# EAGLE design ver_2 (EAGLE 9.6.2)
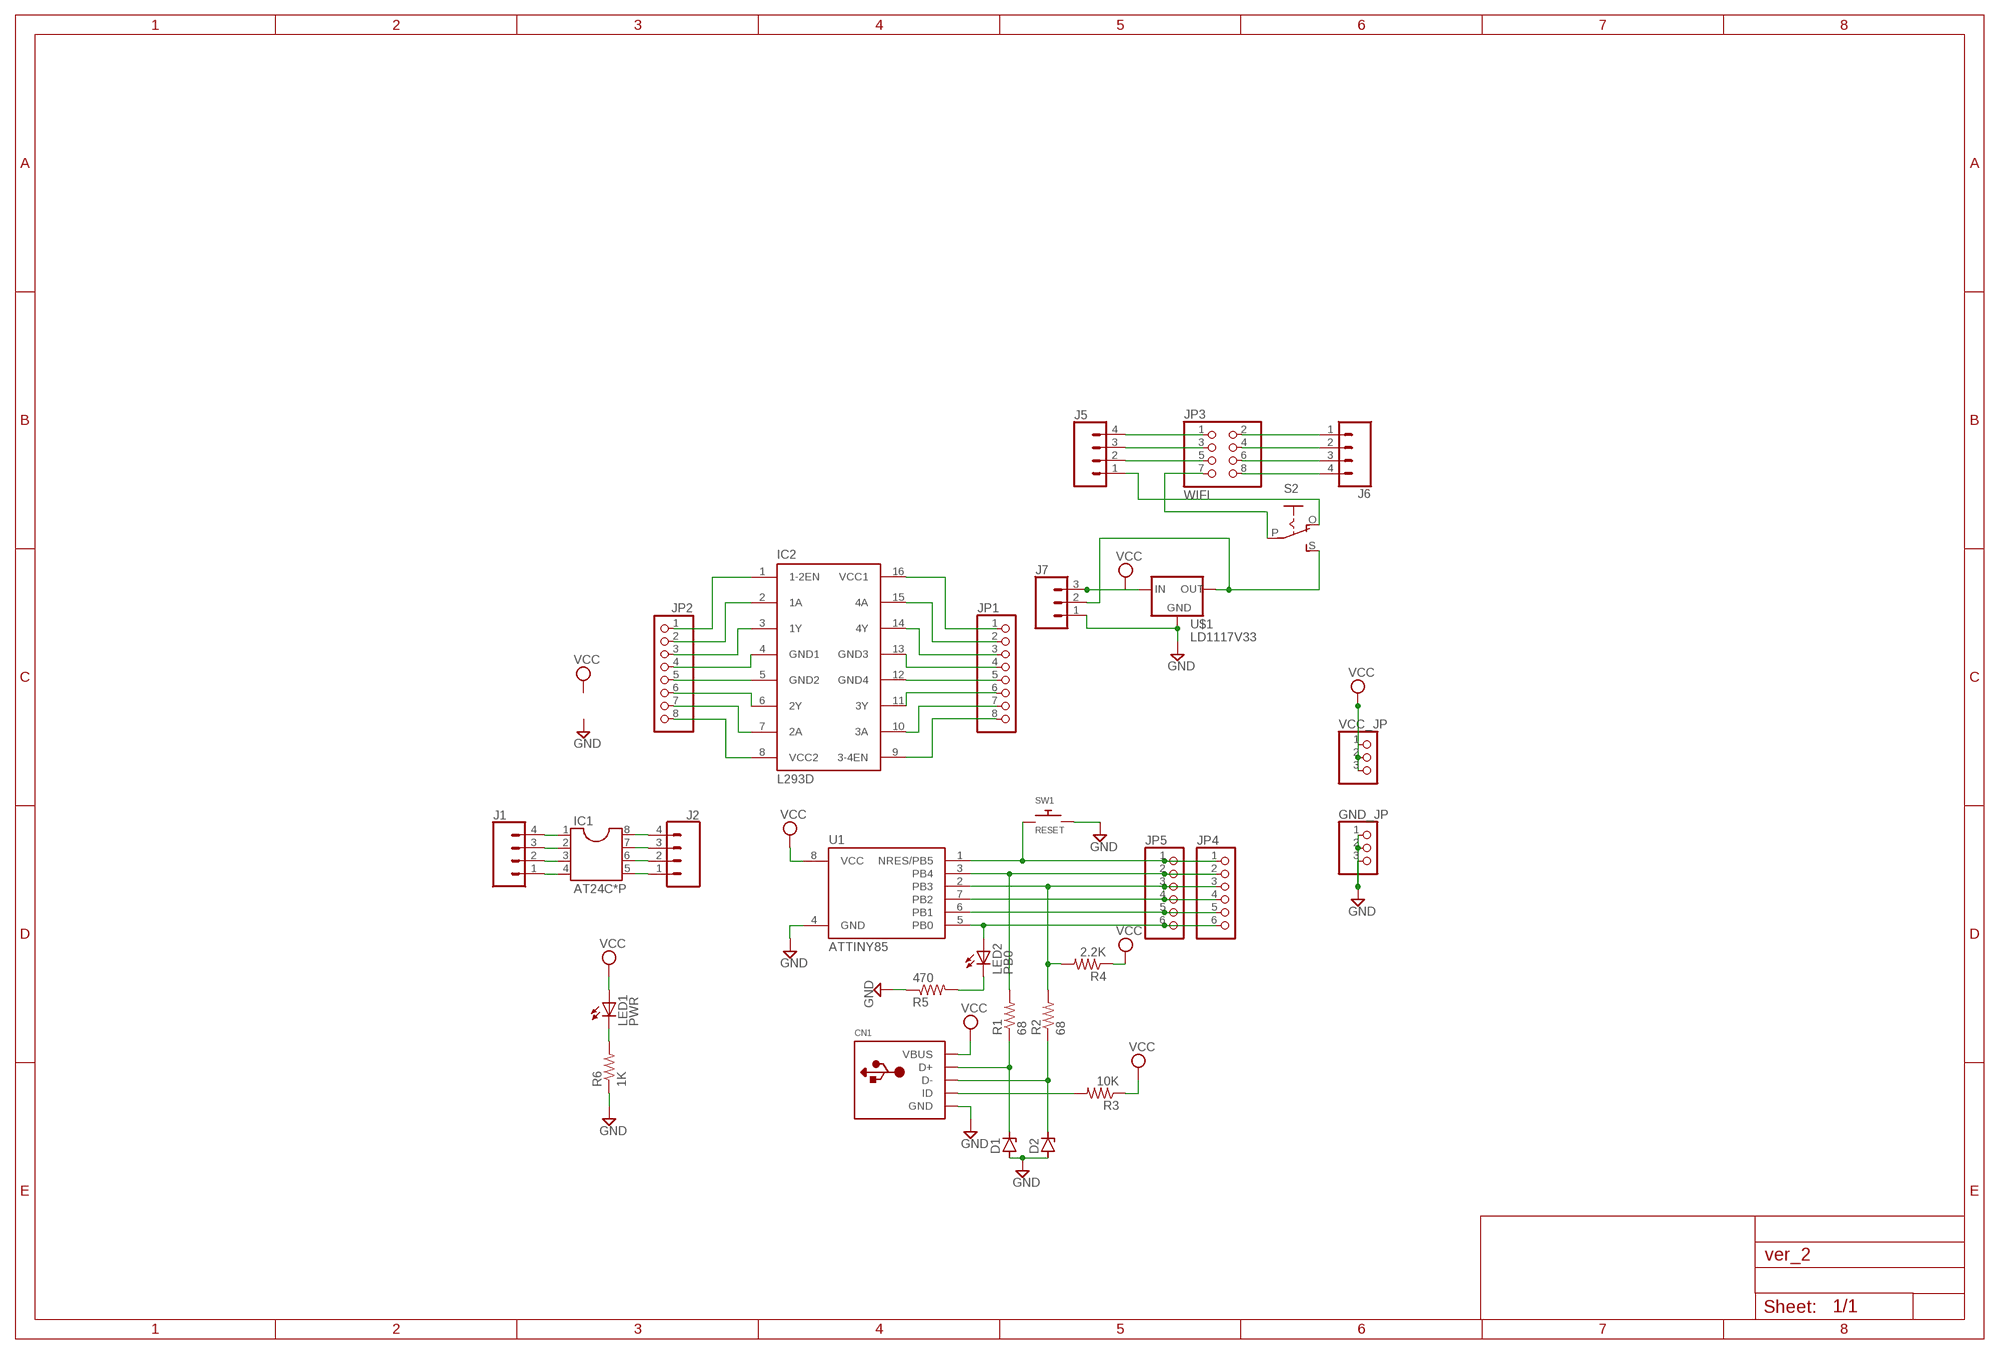
[diagram p0: schematic, sheet 1]

## Parts
CN1  USBTHM  [USB-MINIB-THM]
D1  ZENER-DIODEDO34-7  [DO34Z7]
D2  ZENER-DIODEDO34-7  [DO34Z7]
GND_JP  PINHD-1X3  [1X03]
IC1  AT24C*P  DIL8S  [SOCKET-08]
IC2  L293D  [DIL16]
J1  CONN_041X04_NO_SILK  [1X04_NO_SILK]
J2  CONN_041X04_NO_SILK  [1X04_NO_SILK]
J5  CONN_04PTH  [1X04]
J6  CONN_04PTH  [1X04]
J7  CONN_03  [1X03]
JP1  PINHD-1X8CLEANBIG  [1X08-CLEANBIG]
JP2  PINHD-1X8CLEANBIG  [1X08-CLEANBIG]
JP3  WIFI  PINHD-2X4  [2X04]
JP4  PINHD-1X6  [1X06]
JP5  PINHD-1X6  [1X06]
LED1  PWR  LED3MM  [LED3MM]
LED2  PB0  LED3MM  [LED3MM]
R1  68  R-US_0204/2V  [0204V]
R2  68  R-US_0204/2V  [0204V]
R3  10K  R-US_0204/2V  [0204V]
R4  2.2K  R-US_0204/2V  [0204V]
R5  470  R-US_0204/2V  [0204V]
R6  1K  R-US_0204/2V  [0204V]
S2  EG1218S  [EG1218]
SW1  RESET  SWITCH_PUSHBUTTONEVQ-PE  [TACT_PANA-EVQ]
U1  ATTINY85  ATTINY85-20P  [PDIP08_300MIL]
U$1  LD1117V33  [LD1117V33]
VCC_JP  PINHD-1X3  [1X03]

## Nets
GND: CN1.GND D1.A D2.A GND_JP.1 GND_JP.2 GND_JP.3 J7.1 R5.1 R6.1 SW1.P$2 U1.4(GND) U$1.GND
N$1: JP4.1 JP5.1 SW1.P$1 U1.1(NRES/PB5)
N$2: JP4.2 JP5.2 R1.2 U1.3(PB4)
N$3: JP4.3 JP5.3 R2.2 R4.2 U1.2(PB3)
N$4: JP4.4 JP5.4 U1.7(PB2)
N$5: JP4.5 JP5.5 U1.6(PB1)
N$6: JP4.6 JP5.6 LED2.A U1.5(PB0)
N$7: IC1.4 J1.1
N$8: IC1.3 J1.2
N$9: IC1.2 J1.3
N$10: IC1.1 J1.4
N$11: IC1.5 J2.1
N$12: IC1.6 J2.2
N$13: IC1.7 J2.3
N$14: IC1.8 J2.4
N$15: CN1.ID R3.2
N$16: IC2.4(GND1) JP2.4
N$17: CN1.D+ D1.C R1.1
N$18: CN1.D- D2.C R2.1
N$19: IC2.5(GND2) JP2.5
N$20: IC2.6(2Y) JP2.6
N$21: IC2.7(2A) JP2.7
N$22: IC2.8(VCC2) JP2.8
N$23: IC2.3(1Y) JP2.3
N$24: IC2.2(1A) JP2.2
N$25: IC2.1(1-2EN) JP2.1
N$26: J6.3 JP3.6
N$27: J6.2 JP3.4
N$28: JP3.7 S2.P
N$29: J5.2 JP3.5
N$30: J5.3 JP3.3
N$31: J5.4 JP3.1
N$33: J6.4 JP3.8
N$34: J7.2 S2.S U$1.OUT
N$35: J6.1 JP3.2
N$36: IC2.12(GND4) JP1.5
N$37: IC2.11(3Y) JP1.6
N$38: IC2.10(3A) JP1.7
N$39: IC2.9(3-4EN) JP1.8
N$40: IC2.13(GND3) JP1.4
N$41: IC2.14(4Y) JP1.3
N$42: IC2.15(4A) JP1.2
N$43: IC2.16(VCC1) JP1.1
N$44: LED2.K(C) R5.2
N$45: LED1.K(C) R6.2
N$46: J5.1 S2.O
VCC: CN1.VBUS J7.3 LED1.A R3.1 R4.1 U1.8(VCC) U$1.IN VCC_JP.1 VCC_JP.2 VCC_JP.3

## Library data of the parts
CN1 = adafruit:USB: USB Connectors USBMINIB - Surface Mount Female Mini-B USB Connector 4UConnector: 06564 By microbuilder.eu Thru-hole RA Female Mini-B USB Connector 4UConnector: 18732 By ladyada.net
D1 D2 = diode:ZENER-DIODE: Z-Diode
GND_JP VCC_JP = adafruit:PINHD-1X3: PIN HEADER
IC1 = ic-package:DIL8: Dual In Line / Socket
IC2 = st-microelectronics:L293D: PUSH-PULL 4 CHANNEL DRIVER; MPN: L293D; OC_FARNELL: 9589619; OC_NEWARK: 56P8249
J1 J2 J5 J6 = SparkFun-Connectors:CONN_04: Multi connection point. Often used as Generic Header-pin footprint for 0.1 inch spaced/style header connections On any of the 0.1 inch spaced packages, you can populate with these: Break Away Headers - Straight <https://www.sparkfun.com/products/116> (PRT-00116) Break Away Male Headers - Right Angle <https://www.sparkfun.com/products/553> (PRT-00553) Female Headers <https://www.sparkfun.com/products/115> (PRT-00115) Break Away Headers - Machine Pin <https://www.sparkfun.com/products/117> (PRT-00117) Break Away Female Headers - Swiss Machine Pin <https://www.sparkfun.com/products/743> (PRT-00743) For SCREWTERMINALS and SPRING TERMINALS visit here: Screw Terimnals on SparkFun.com <https://www.sparkfun.com/search/results?term=Screw+Terminals> (5mm/3.5mm/2.54mm spacing) This device is also useful as a general connection point to wire up your design to another part of your project. Our various solder wires solder well into these plated through hole pads. Hook-Up Wire - Assortment (Stranded, 22 AWG) <https://www.sparkfun.com/products/11375> (PRT-11375) Hook-Up Wire - Assortment (Solid Core, 22 AWG) <https://www.sparkfun.com/products/11367> (PRT-11367) View the entire wire category on our website here <https://www.sparkfun.com/categories/141> Special notes: Molex polarized connector foot print use with SKU : PRT-08231 with associated crimp pins and housings. 1MM SMD Version SKU: PRT-10208; PROD_ID: CONN-09696
J7 = SparkFun-Connectors:CONN_03: Multi connection point. Often used as Generic Header-pin footprint for 0.1 inch spaced/style header connections On any of the 0.1 inch spaced packages, you can populate with these: Break Away Headers - Straight <https://www.sparkfun.com/products/116> (PRT-00116) Break Away Male Headers - Right Angle <https://www.sparkfun.com/products/553> (PRT-00553) Female Headers <https://www.sparkfun.com/products/115> (PRT-00115) Break Away Headers - Machine Pin <https://www.sparkfun.com/products/117> (PRT-00117) Break Away Female Headers - Swiss Machine Pin <https://www.sparkfun.com/products/743> (PRT-00743) Stackable Header - 3 Pin (Female, 0.1") <https://www.sparkfun.com/products/13875> (PRT-13875) For SCREWTERMINALS and SPRING TERMINALS visit here: Screw Terimnals on SparkFun.com <https://www.sparkfun.com/search/results?term=Screw+Terminals> (5mm/3.5mm/2.54mm spacing) This device is also useful as a general connection point to wire up your design to another part of your project. Our various solder wires solder well into these plated through hole pads. Hook-Up Wire - Assortment (Stranded, 22 AWG) <https://www.sparkfun.com/products/11375> (PRT-11375) Hook-Up Wire - Assortment (Solid Core, 22 AWG) <https://www.sparkfun.com/products/11367> (PRT-11367) View the entire wire category on our website here <https://www.sparkfun.com/categories/141> Special notes: Molex polarized connector foot print use with SKU : PRT-08232 with associated crimp pins and housings.; PROD_ID: XXX-00000; VALUE: 455-1750-1-ND
JP1 JP2 = adafruit:PINHD-1X8: PIN HEADER
JP3 = adafruit:PINHD-2X4: PIN HEADER
JP4 JP5 = adafruit:PINHD-1X6: PIN HEADER
LED1 LED2 = adafruit:LED: LED OSRAM: - CHIPLED LG R971, LG N971, LY N971, LG Q971, LY Q971, LO R971, LY R971 LH N974, LH R974 LS Q976, LO Q976, LY Q976 LO Q996 - Hyper CHIPLED LW Q18S LB Q993, LB Q99A, LB R99A - SideLED LS A670, LO A670, LY A670, LG A670, LP A670 LB A673, LV A673, LT A673, LW A673 LH A674 LY A675 LS A676, LA A676, LO A676, LY A676, LW A676 LS A679, LY A679, LG A679 - Hyper Micro SIDELED® LS Y876, LA Y876, LO Y876, LY Y876 LT Y87S - SmartLED LW L88C, LW L88S LB L89C, LB L89S, LG L890 LS L89K, LO L89K, LY L89K LS L896, LA L896, LO L896, LY L896 - TOPLED LS T670, LO T670, LY T670, LG T670, LP T670 LSG T670, LSP T670, LSY T670, LOP T670, LYG T670 LG T671, LOG T671, LSG T671 LB T673, LV T673, LT T673, LW T673 LH T674 LS T676, LA T676, LO T676, LY T676, LB T676, LH T676, LSB T676, LW T676 LB T67C, LV T67C, LT T67C, LS T67K, LO T67K, LY T67K, LW E67C LS E67B, LA E67B, LO E67B, LY E67B, LB E67C, LV E67C, LT E67C LW T67C LS T679, LY T679, LG T679 LS T770, LO T770, LY T770, LG T770, LP T770 LB T773, LV T773, LT T773, LW T773 LH T774 LS E675, LA E675, LY E675, LS T675 LS T776, LA T776, LO T776, LY T776, LB T776 LHGB T686 LT T68C, LB T68C - Hyper Mini TOPLED® LB M676 - Mini TOPLED Santana® LG M470 LS M47K, LO M47K, LY M47K Source: http://www.osram.convergy.de/
R1-R6 = adafruit:R-US_: RESISTOR, American symbol
S2 = adafruit:EG1218: SLIDING SWITCH 0.1" spacing through hole, vertical SPDT slide switch http://www.ladyada.net/library/pcb/eaglelibrary.html
SW1 = adafruit:SWITCH_PUSHBUTTON: Buttons SOFTTOUCHSMD_SJ - Soft touch temporary push button (Super Junk Akihabara) Compatible with SKPMANE010 [Mouser: 688-SKPMAN] C&K_KSS = Digikey: KSS221GLFS
U1 = _hhn_attiny25_45_85:ATTINY85*: ATMEL ATtiny 85 Packages: P = PDIP 08 30mil S = SOIC 08 EIAJ 208mil Technologies Note: for complete ordering code (temp. range, finish, tape&reel etc.) see www.atmel.com • Supply Voltage: V = (1.8…5.5)V | [blank] = (2.7…5.5)V • Speed: 10 = 10 MHz | 20 = 20 MHz Author: Dipl.-Ing. FH Rainer Bayer HHN Hochschule Heilbronn (Heilbronn University), rainer.bayer@hs-heilbronn.de Ingenieurbüro ing-rb, mail@ing-rb.de
U$1 = LD1117V33:LD1117V33

## Board
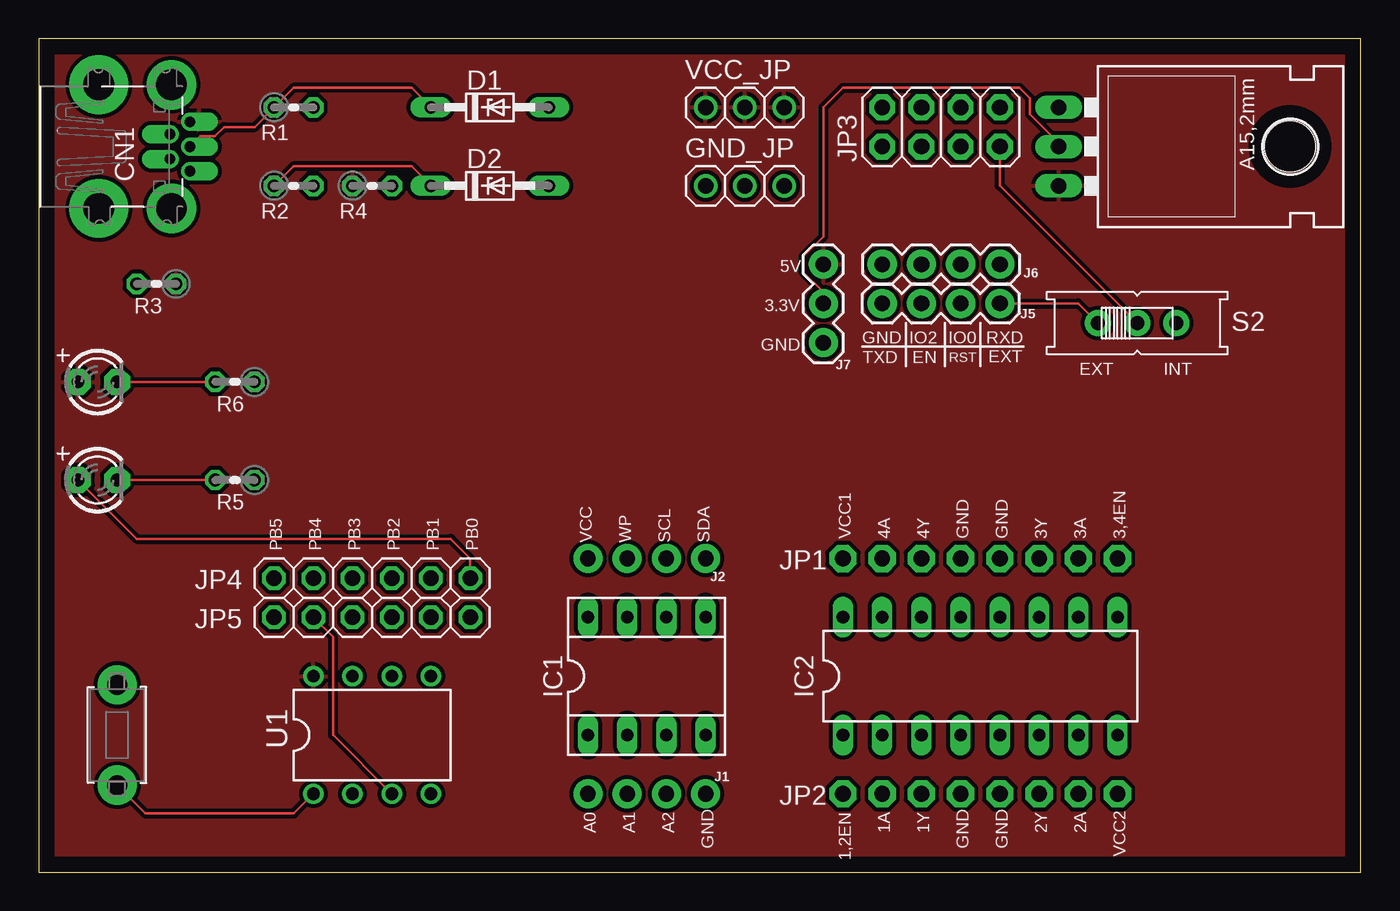
[diagram p1: board, top side]
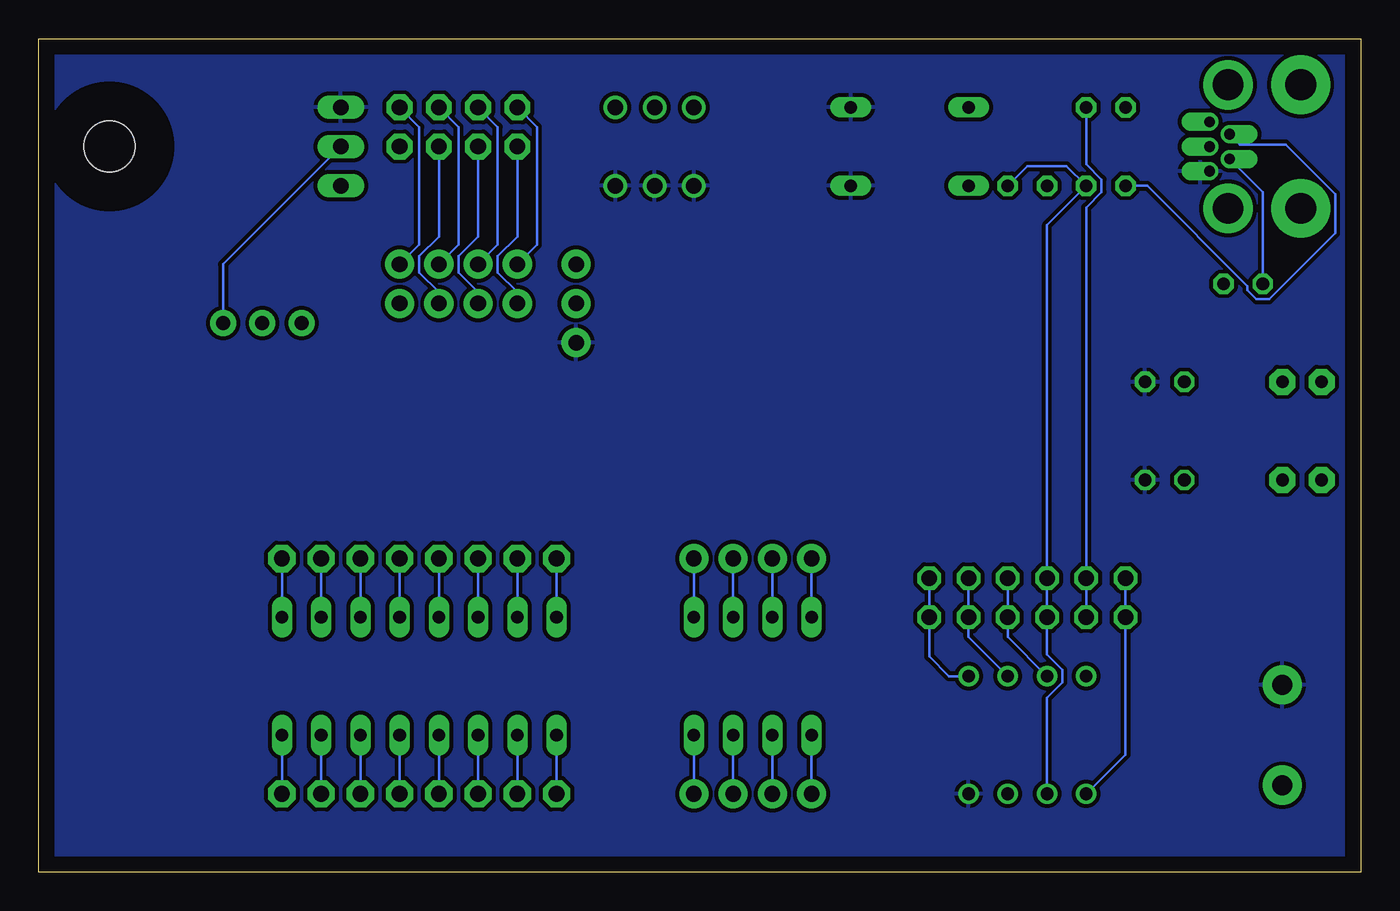
[diagram p2: board, bottom side, seen from below]

Size 85.6 x 53.98 mm. Coordinates in mm from the lower left corner, seen from the top.
Outline: 0,0 85.6,0 85.6,53.98 0,53.98 0,0
Copper layers (1*16): Top 0.035mm / dielectric 1.5mm / Bottom 0.035mm
Design rules "default *": minimum track width 6mil, minimum drill 0.35mm, track to track 10mil, track to pad 10mil, pad to pad 10mil, via to via 10mil, smd to smd 6mil, copper to edge 40mil, drill to drill 6mil, minimum pad ring 10mil, minimum via ring 8mil, stop-mask expansion 4mil, vias tented up to drill 0mil, thermal gap 10mil

### Footprints (pad centres in the part's own frame; a part is rotated, then mirrored left to right if it is on the bottom)
USB-MINIB-THM = drill 0.7 offset: D+ 0,9.8; D- -0.8,8.5; GND 1.6,9.8; ID 0.8,8.5; VBUS -1.6,9.8 | drill 2 pad 3.81: GND1 -4,3.9; GND4 4,3.9 | drill 2 pad 3.2: GND2 -4,8.6; GND3 4,8.6
DO34Z7 = drill 0.813 long: A 3.81,0; C -3.81,0
1X03 = drill 1.016: 1 -2.54,0; 2 0,0; 3 2.54,0
SOCKET-08 = drill 0.813 long: 1 -3.81,-3.81; 2 -1.27,-3.81; 3 1.27,-3.81; 4 3.81,-3.81; 5 3.81,3.81; 6 1.27,3.81; 7 -1.27,3.81; 8 -3.81,3.81
DIL16 = drill 0.813 long: 1 -8.89,-3.81; 2 -6.35,-3.81; 3 -3.81,-3.81; 4 -1.27,-3.81; 5 1.27,-3.81; 6 3.81,-3.81; 7 6.35,-3.81; 8 8.89,-3.81; 9 8.89,3.81; 10 6.35,3.81; 11 3.81,3.81; 12 1.27,3.81; 13 -1.27,3.81; 14 -3.81,3.81; 15 -6.35,3.81; 16 -8.89,3.81
1X04_NO_SILK = drill 1.016 pad 1.88: 1 0,0; 2 2.54,0; 3 5.08,0; 4 7.62,0
1X04 = drill 1.016 pad 1.88: 1 0,0; 2 2.54,0; 3 5.08,0; 4 7.62,0
1X03' = drill 1.016 pad 1.88: 1 0,0; 2 2.54,0; 3 5.08,0
1X08-CLEANBIG = drill 1.016 pad 1.778 octagon: 1 -8.89,0; 2 -6.35,0; 3 -3.81,0; 4 -1.27,0; 5 1.27,0; 6 3.81,0; 7 6.35,0; 8 8.89,0
2X04 = drill 1.016 pad 1.676 octagon: 1 -3.81,-1.27; 2 -3.81,1.27; 3 -1.27,-1.27; 4 -1.27,1.27; 5 1.27,-1.27; 6 1.27,1.27; 7 3.81,-1.27; 8 3.81,1.27
1X06 = drill 1.016 octagon: 1 -6.35,0; 2 -3.81,0; 3 -1.27,0; 4 1.27,0; 5 3.81,0; 6 6.35,0
LED3MM = drill 0.813 pad 1.676 octagon: A -1.27,0; K 1.27,0
0204V = drill 0.813 octagon: 1 -1.27,0; 2 1.27,0
EG1218 = drill 0.9 pad 1.676: O -2.54,0; P 0,0; S 2.54,0
TACT_PANA-EVQ = drill 1.3 pad 2.54: P$1 -3.25,0; P$2 3.25,0
PDIP08_300MIL = drill 0.813: 1 -3.81,-3.81; 2 -1.27,-3.81; 3 1.27,-3.81; 4 3.81,-3.81; 5 3.81,3.81; 6 1.27,3.81; 7 -1.27,3.81; 8 -3.81,3.81
LD1117V33 = drill 1.016 long: GND -2.54,-8.89; IN 2.54,-8.89; OUT 0,-8.89 | hole 3.302: 0,6.096

### Placement (x,y rotation side)
CN1  0,46.99 270 top
D1  29.21,49.53 0 top
D2  29.21,44.45 0 top
GND_JP  45.72,44.45 0 top
IC1  39.37,12.7 0 top
IC2  60.96,12.7 0 top
J1  43.18,5.08 180 top
J2  43.18,20.32 180 top
J5  62.23,36.83 180 top
J6  54.61,39.37 0 top
J7  [1X03']  50.8,34.29 90 top
JP1  60.96,20.32 0 top
JP2  60.96,5.08 0 top
JP3  58.42,48.26 0 top
JP4  21.59,19.05 0 top
JP5  21.59,16.51 0 top
LED1  3.81,31.75 0 top
LED2  3.81,25.4 0 top
R1  16.51,49.53 0 top
R2  16.51,44.45 0 top
R3  7.62,38.1 180 top
R4  21.59,44.45 0 top
R5  12.7,25.4 180 top
R6  12.7,31.75 180 top
S2  71.12,35.56 0 top
SW1  5.08,8.89 90 top
U1  21.59,8.89 0 top
U$1  74.93,46.99 270 top
VCC_JP  45.72,49.53 0 top

### Tracks (layer width: path | path; a pad name or v marks a point on that pad's centre or on a via)
GND
  pour Bottom: 0,0 0,54.61 86.36,54.61 86.36,0
N$1
  Top 0.152: SW1.P$1 6.91,3.81 16.51,3.81 U1.1
  Bottom 0.152: JP4.1 JP5.1 15.24,7.62 U1.1
N$2
  Top 0.152: U1.3 19.05,8.89 19.05,15.24 JP5.2
  Bottom 0.152: JP5.2 JP4.2 17.78,43.05 16.79,44.04 16.79,44.86 17.78,45.85 R1.2
N$3
  Bottom 0.152: U1.2 20.32,11.3 19.33,12.29 19.33,13.11 20.32,14.1 JP5.3 JP4.3 20.32,41.91 R2.2 19.05,45.72 21.59,45.72 R4.2
N$4
  Bottom 0.152: JP4.4 JP5.4 22.86,15.24 U1.7
N$5
  Bottom 0.152: JP4.5 JP5.5 25.4,15.24 U1.6
N$6
  Top 0.152: LED2.A 6.35,21.59 26.67,21.59 27.94,20.32 JP4.6
  Bottom 0.152: JP4.6 JP5.6 27.94,13.97 26.67,12.7 U1.5
N$7
  Bottom 0.152: IC1.4 J1.1
N$8
  Bottom 0.152: IC1.3 J1.2
N$9
  Bottom 0.152: IC1.2 J1.3
N$10
  Bottom 0.152: IC1.1 J1.4
N$11
  Bottom 0.152: J2.1 IC1.5
N$12
  Bottom 0.152: J2.2 IC1.6
N$13
  Bottom 0.152: J2.3 IC1.7
N$14
  Bottom 0.152: J2.4 IC1.8
N$15
  Bottom 0.152: CN1.ID 6.35,44.04 R3.2
N$16
  Bottom 0.152: IC2.4 JP2.4
N$17
  Top 0.152: CN1.D+ 10.47,47.66 11.39,47.66 12,48.26 13.97,48.26 R1.1 16.51,50.8 24.13,50.8 D1.C
N$18
  Top 0.152: D2.C 24.13,45.72 16.51,45.72 R2.1
  Bottom 0.152: CN1.D- 7.83,47.12 4.87,47.12 1.67,43.92 1.67,41.38 5.94,37.11 6.76,37.11 7.34,37.69 7.34,37.95 13.84,44.45 R2.1
N$19
  Bottom 0.152: IC2.5 JP2.5
N$20
  Bottom 0.152: IC2.6 JP2.6
N$21
  Bottom 0.152: IC2.7 JP2.7
N$22
  Bottom 0.152: IC2.8 JP2.8
N$23
  Bottom 0.152: IC2.3 JP2.3
N$24
  Bottom 0.152: IC2.2 JP2.2
N$25
  Bottom 0.152: IC2.1 JP2.1
N$26
  Bottom 0.152: J6.3 58.42,40.64 58.42,48.26 JP3.6
N$27
  Bottom 0.152: J6.2 55.88,40.64 55.88,48.26 JP3.4
N$28
  Top 0.152: S2.P 62.23,44.45 JP3.7
N$29
  Bottom 0.152: J5.2 59.69,37.57 60.96,38.84 60.96,39.9 59.69,41.17 JP3.5
N$30
  Bottom 0.152: J5.3 57.15,37.57 58.42,38.84 58.42,39.9 57.15,41.17 JP3.3
N$31
  Bottom 0.152: J5.4 54.61,37.57 55.88,38.84 55.88,39.9 54.61,41.17 JP3.1
N$33
  Bottom 0.152: J6.4 60.96,40.64 60.96,48.26 JP3.8
N$34
  Top 0.152: J7.2 50.8,37.57 49.53,38.84 49.53,39.9 50.8,41.17 50.8,49.53 52.07,50.8 63.5,50.8 64.19,50.11 64.19,49.08 66.04,47.22 U$1.OUT
  Bottom 0.152: U$1.OUT 73.66,39.37 S2.S
N$35
  Bottom 0.152: J6.1 53.34,40.64 53.34,48.26 JP3.2
N$36
  Bottom 0.152: IC2.12 JP1.5
N$37
  Bottom 0.152: IC2.11 JP1.6
N$38
  Bottom 0.152: IC2.10 JP1.7
N$39
  Bottom 0.152: IC2.9 JP1.8
N$40
  Bottom 0.152: IC2.13 JP1.4
N$41
  Bottom 0.152: IC2.14 JP1.3
N$42
  Bottom 0.152: IC2.15 JP1.2
N$43
  Bottom 0.152: IC2.16 JP1.1
N$44
  Top 0.152: LED2.K R5.2
N$45
  Top 0.152: LED1.K R6.2
N$46
  Top 0.152: J5.1 67.31,36.83 S2.O
VCC
  pour Top: 0,0 0,54.61 86.36,54.61 86.36,0

### Text on the board
tNames: 5V | 3.3V | GND | IO2 | IO0 | RXD | GND | TXD | EN | RST | EXT | EXT | INT | VCC1 | 4A | 4Y | GND | GND | 3Y | 3A | 3,4EN | PB5 | PB4 | PB3 | PB2 | PB1 | PB0 | VCC | WP | SCL | SDA | A0 | A1 | A2 | 1A | 1Y | 2Y | 2A | GND | GND | GND | 1,2EN | VCC2
tValues: $1 ATtiny85 Board | 1. Plug in board | 2. Verify Blink Works | 3. Scan QR Code | 4. Have Fun! | Examples on Github!